# EAGLE schematic mmu6100x (EAGLE 6.6.0)

## Sheet 1 of 3
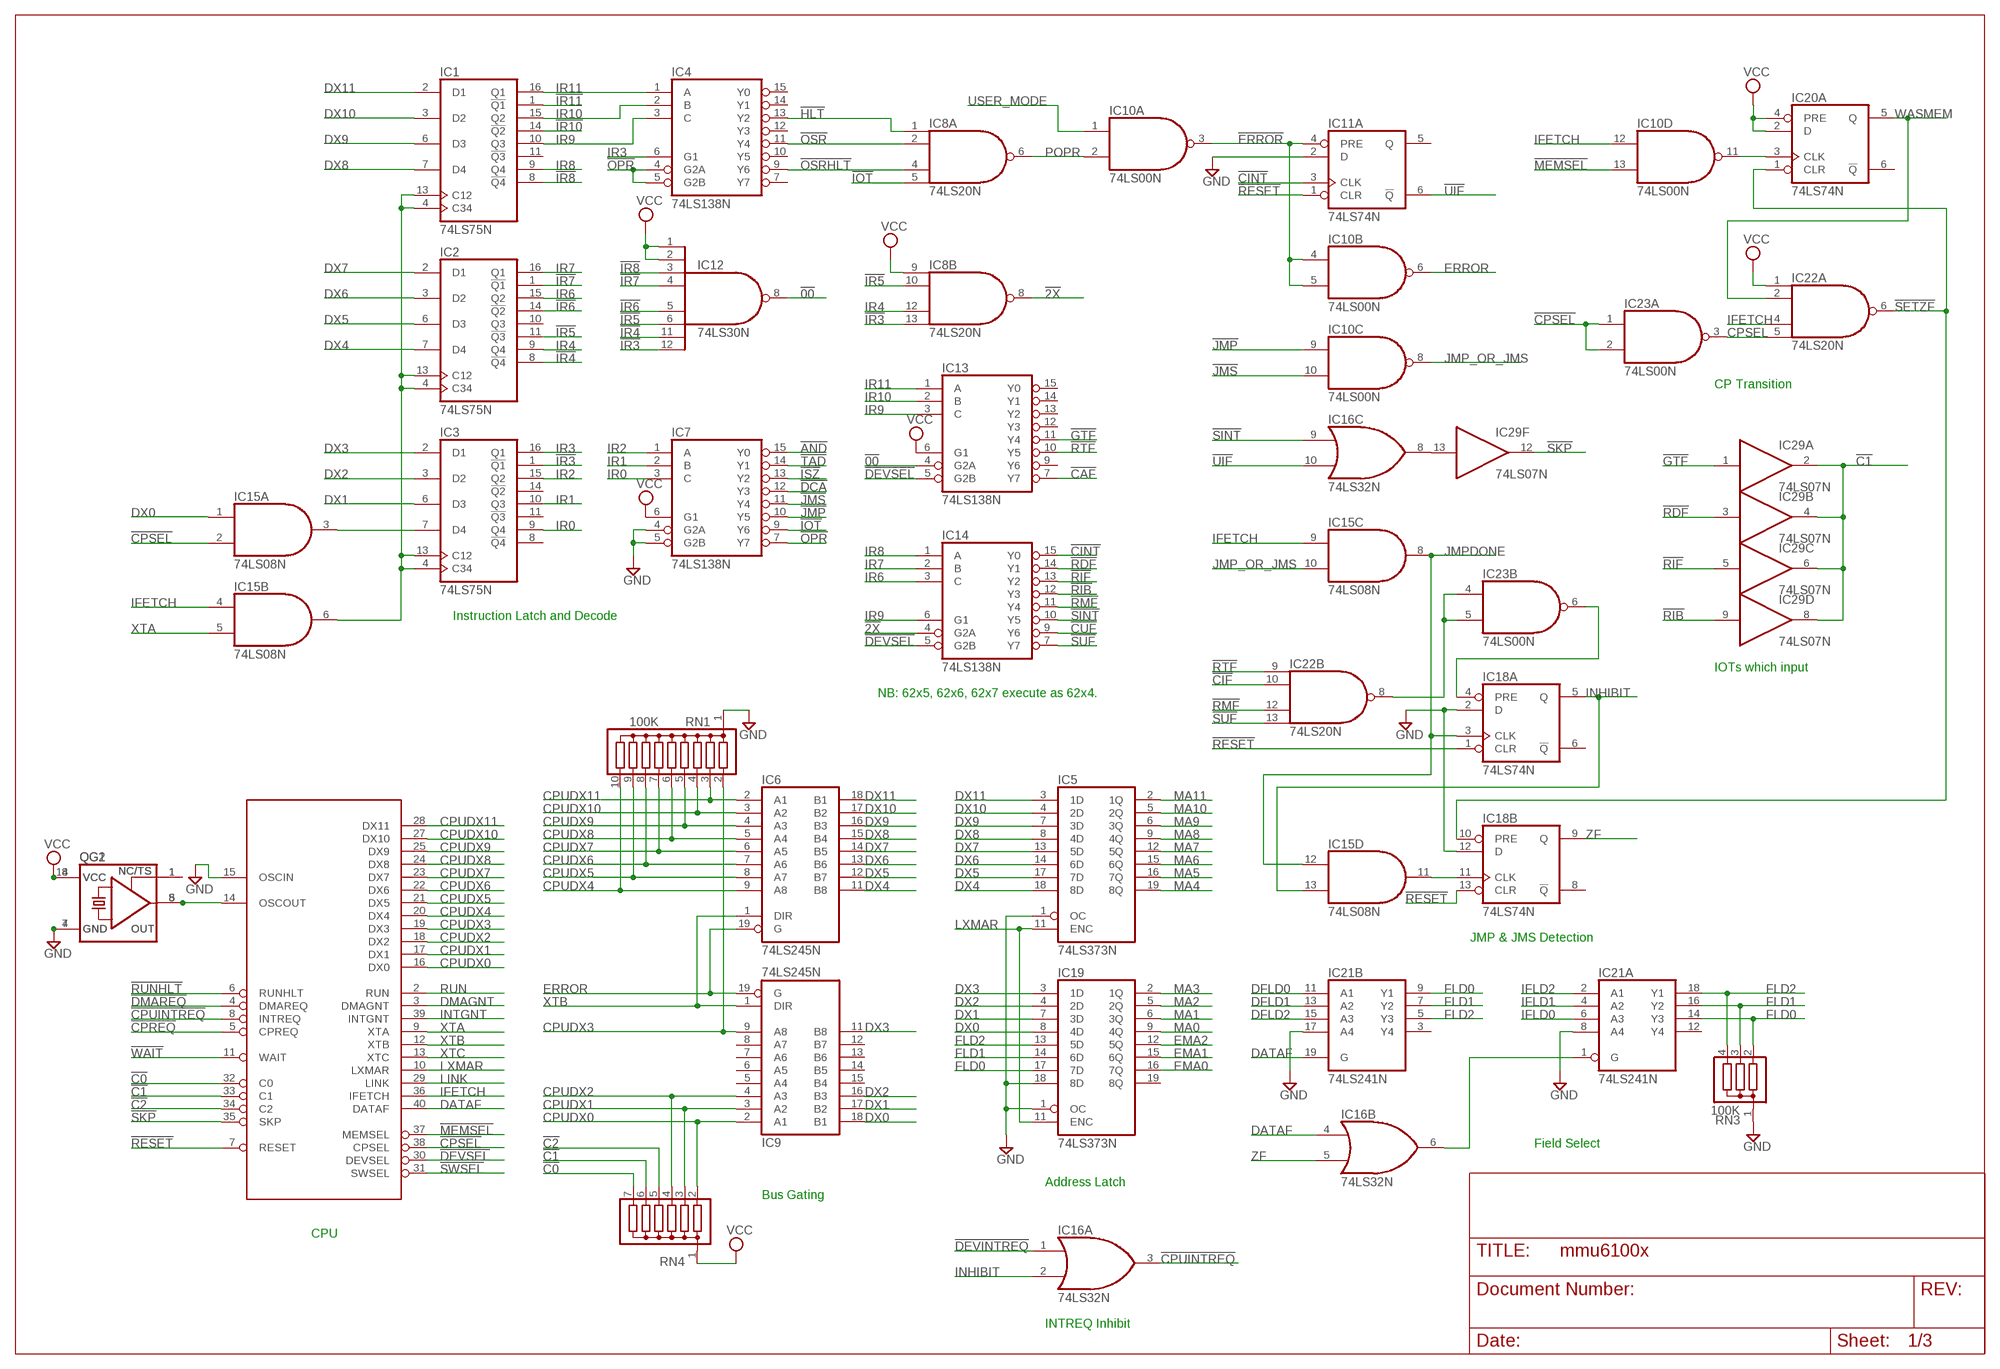
[diagram p0: schematic, sheet 1]

### Parts
CPU  IM6100  [DIL40]
IC1  74LS75N  [DIL16]
IC2  74LS75N  [DIL16]
IC3  74LS75N  [DIL16]
IC4  74LS138N  [DIL16]
IC5  74LS373N  [DIL20]
IC6  74LS245N  [DIL20]
IC7  74LS138N  [DIL16]
IC8  74LS20N  [DIL14]
IC9  74LS245N  [DIL20]
IC10  74LS00N  [DIL14]
IC11  74LS74N  [DIL14]
IC12  74LS30N  [DIL14]
IC13  74LS138N  [DIL16]
IC14  74LS138N  [DIL16]
IC15  74LS08N  [DIL14]
IC16  74LS32N  [DIL14]
IC18  74LS74N  [DIL14]
IC19  74LS373N  [DIL20]
IC20  74LS74N  [DIL14]
IC21  74LS241N  [DIL20]
IC22  74LS20N  [DIL14]
IC23  74LS00N  [DIL14]
IC29  74LS07N  [DIL14]
QG1  XO-8  [DIL08S]
QG2  XO-14  [DIL14S]
RN1  100K  G09R  [SIL10]
RN3  100K  G03R  [SIL4]
RN4  G06R  [SIL7]

### Nets
!00: IC12.8(O) IC13.4(G2A)
!2X: IC8.8(B:O) IC14.4(G2A) ; also sheet 2
!AND: IC7.15(Y0) ; also sheet 3
!C0: CPU.32(C0) RN4.7 ; also sheet 3
!C1: CPU.33(C1) IC29.2(A:O) IC29.4(B:O) IC29.6(C:O) IC29.8(D:O) RN4.6 ; also sheet 3
!C2: CPU.34(C2) RN4.5 ; also sheet 3
!CAF: IC13.7(Y7) ; also sheet 2
!CIF: IC22.10(B:I1) ; also sheet 2
!CINT: IC11.3(A:CLK) IC14.15(Y0)
!CPREQ: CPU.5(CPREQ) ; also sheet 3
!CPSEL: CPU.38(CPSEL) IC15.2(A:I1) IC23.1(A:I0) IC23.2(A:I1)
!CPUINTREQ: CPU.8(INTREQ) IC16.3(A:O)
!CUF: IC14.9(Y6) ; also sheet 2
!DCA: IC7.12(Y3) ; also sheet 3
!DEVINTREQ: IC16.1(A:I0) ; also sheet 2,3
!DEVSEL: CPU.30(DEVSEL) IC13.5(G2B) IC14.5(G2B) ; also sheet 3
!DMAREQ: CPU.4(DMAREQ) ; also sheet 3
!ERROR: IC10.3(A:O) IC10.4(B:I0) IC10.5(B:I1) IC11.4(A:PRE)
!GTF: IC13.11(Y4) IC29.1(A:I) ; also sheet 2
!HLT: IC4.13(Y2) IC8.1(A:I0)
!IOT: IC7.9(Y6) IC8.5(A:I3) ; also sheet 2
!IR3: IC3.1(!Q1) IC8.13(B:I3) IC12.12(I7)
!IR4: IC2.8(!Q4) IC12.11(I6)
!IR5: IC2.11(!Q3) IC8.10(B:I1) IC12.6(I5)
!IR6: IC2.14(!Q2) IC12.5(I4)
!IR7: IC2.1(!Q1) IC12.4(I3)
!IR8: IC1.8(!Q4) IC12.3(I2)
!IR10: IC1.14(!Q2) ; also sheet 2
!IR11: IC1.1(!Q1) ; also sheet 2
!ISZ: IC7.13(Y2) ; also sheet 3
!JMP: IC7.10(Y5) IC10.9(C:I0)
!JMS: IC7.11(Y4) IC10.10(C:I1)
!MEMSEL: CPU.37(MEMSEL) IC10.13(D:I1) ; also sheet 3
!OPR: IC4.4(G2A) IC4.5(G2B) IC7.7(Y7)
!OSR: IC4.11(Y4) IC8.2(A:I1)
!OSRHLT: IC4.9(Y6) IC8.4(A:I2)
!RDF: IC14.14(Y1) IC29.3(B:I) ; also sheet 2
!RESET: CPU.7(RESET) IC11.1(A:CLR) IC18.1(A:CLR) IC18.13(B:CLR) ; also sheet 2,3
!RIB: IC14.12(Y3) IC29.9(D:I) ; also sheet 2
!RIF: IC14.13(Y2) IC29.5(C:I) ; also sheet 2
!RMF: IC14.11(Y4) IC22.12(B:I2) ; also sheet 2
!RTF: IC13.10(Y5) IC22.9(B:I0) ; also sheet 2
!RUNHLT: CPU.6(RUNHLT) ; also sheet 3
!SETZF: IC18.10(B:PRE) IC20.1(A:CLR) IC22.6(A:O)
!SINT: IC14.10(Y5) IC16.9(C:I0)
!SKP: CPU.35(SKP) IC29.12(F:O) ; also sheet 3
!SUF: IC14.7(Y7) IC22.13(B:I3) ; also sheet 2
!SWSEL: CPU.31(SWSEL) ; also sheet 3
!TAD: IC7.14(Y1) ; also sheet 3
!UIF: IC11.6(A:!Q) IC16.10(C:I1)
!WAIT: CPU.11(WAIT) ; also sheet 3
CPSEL: IC22.5(A:I3) IC23.3(A:O)
CPUDX0: CPU.16(DX0) IC9.2(A1) RN4.2
CPUDX1: CPU.17(DX1) IC9.3(A2) RN4.3
CPUDX2: CPU.18(DX2) IC9.4(A3) RN4.4
CPUDX3: CPU.19(DX3) IC9.9(A8) RN1.2
CPUDX4: CPU.20(DX4) IC6.9(A8) RN1.10
CPUDX5: CPU.21(DX5) IC6.8(A7) RN1.9
CPUDX6: CPU.22(DX6) IC6.7(A6) RN1.8
CPUDX7: CPU.23(DX7) IC6.6(A5) RN1.7
CPUDX8: CPU.24(DX8) IC6.5(A4) RN1.6
CPUDX9: CPU.25(DX9) IC6.4(A3) RN1.5
CPUDX10: CPU.27(DX10) IC6.3(A2) RN1.4
CPUDX11: CPU.28(DX11) IC6.2(A1) RN1.3
DATAF: CPU.40(DATAF) IC16.4(B:I0) IC21.19(B:G)
DFLD0: IC21.11(B:A1) ; also sheet 2
DFLD1: IC21.13(B:A2) ; also sheet 2
DFLD2: IC21.15(B:A3) ; also sheet 2
DMAGNT: CPU.3(DMAGNT) ; also sheet 3
DX0: IC9.18(B1) IC15.1(A:I0) IC19.8(4D) ; also sheet 2,3
DX1: IC3.6(D3) IC9.17(B2) IC19.7(3D) ; also sheet 2,3
DX2: IC3.3(D2) IC9.16(B3) IC19.4(2D) ; also sheet 2,3
DX3: IC3.2(D1) IC9.11(B8) IC19.3(1D) ; also sheet 2,3
DX4: IC2.7(D4) IC5.18(8D) IC6.11(B8) ; also sheet 2,3
DX5: IC2.6(D3) IC5.17(7D) IC6.12(B7) ; also sheet 2,3
DX6: IC2.3(D2) IC5.14(6D) IC6.13(B6) ; also sheet 2,3
DX7: IC2.2(D1) IC5.13(5D) IC6.14(B5) ; also sheet 2,3
DX8: IC1.7(D4) IC5.8(4D) IC6.15(B4) ; also sheet 2,3
DX9: IC1.6(D3) IC5.7(3D) IC6.16(B3) ; also sheet 2,3
DX10: IC1.3(D2) IC5.4(2D) IC6.17(B2) ; also sheet 2,3
DX11: IC1.2(D1) IC5.3(1D) IC6.18(B1) ; also sheet 2,3
EMA0: IC19.16(7Q) ; also sheet 3
EMA1: IC19.15(6Q) ; also sheet 3
EMA2: IC19.12(5Q) ; also sheet 3
ERROR: IC6.19(G) IC9.19(G) IC10.6(B:O)
FLD0: IC19.17(7D) IC21.9(B:Y1) IC21.14(A:Y3) RN3.2
FLD1: IC19.14(6D) IC21.7(B:Y2) IC21.16(A:Y2) RN3.3
FLD2: IC19.13(5D) IC21.5(B:Y3) IC21.18(A:Y1) RN3.4
GND: CPU.15(OSCIN) IC5.1(OC) IC7.4(G2A) IC7.5(G2B) IC11.2(A:D) IC18.2(A:D) IC18.12(B:D) IC19.1(OC) IC19.18(8D) IC21.8(A:A4) IC21.17(B:A4) QG1.4(GND) QG2.7(GND) RN1.1 RN3.1 ; also sheet 2,3
IFETCH: CPU.36(IFETCH) IC10.12(D:I0) IC15.4(B:I0) IC15.9(C:I0) IC22.4(A:I2)
IFLD0: IC21.6(A:A3) ; also sheet 2
IFLD1: IC21.4(A:A2) ; also sheet 2
IFLD2: IC21.2(A:A1) ; also sheet 2
INHIBIT: IC15.13(D:I1) IC16.2(A:I1) IC18.5(A:Q) ; also sheet 2
INTGNT: CPU.39(INTGNT) ; also sheet 2,3
IR0: IC3.9(Q4) IC7.3(C)
IR1: IC3.10(Q3) IC7.2(B)
IR2: IC3.15(Q2) IC7.1(A)
IR3: IC3.16(Q1) IC4.6(G1)
IR4: IC2.9(Q4) IC8.12(B:I2)
IR6: IC2.15(Q2) IC14.3(C) ; also sheet 2
IR7: IC2.16(Q1) IC14.2(B) ; also sheet 2
IR8: IC1.9(Q4) IC14.1(A) ; also sheet 2
IR9: IC1.10(Q3) IC4.3(C) IC13.3(C) IC14.6(G1) ; also sheet 2
IR10: IC1.15(Q2) IC4.2(B) IC13.2(B)
IR11: IC1.16(Q1) IC4.1(A) IC13.1(A)
JMP_OR_JMS: IC10.8(C:O) IC15.10(C:I1)
JMPDONE: IC15.8(C:O) IC15.12(D:I0) IC18.3(A:CLK) ; also sheet 2
LINK: CPU.29(LINK) ; also sheet 3
LXMAR: CPU.10(LXMAR) IC5.11(ENC) IC19.11(ENC) ; also sheet 2,3
MA0: IC19.9(4Q) ; also sheet 3
MA1: IC19.6(3Q) ; also sheet 3
MA2: IC19.5(2Q) ; also sheet 3
MA3: IC19.2(1Q) ; also sheet 3
MA4: IC5.19(8Q) ; also sheet 3
MA5: IC5.16(7Q) ; also sheet 3
MA6: IC5.15(6Q) ; also sheet 3
MA7: IC5.12(5Q) ; also sheet 3
MA8: IC5.9(4Q) ; also sheet 3
MA9: IC5.6(3Q) ; also sheet 3
MA10: IC5.5(2Q) ; also sheet 3
MA11: IC5.2(1Q) ; also sheet 3
N$2: QG1.1(TS) QG2.1(TS)
N$3: IC1.4(C34) IC1.13(C12) IC2.4(C34) IC2.13(C12) IC3.4(C34) IC3.13(C12) IC15.6(B:O)
N$5: IC15.11(D:O) IC18.11(B:CLK)
N$6: IC10.11(D:O) IC20.3(A:CLK)
N$8: IC16.6(B:O) IC21.1(A:G)
N$15: IC3.7(D4) IC15.3(A:O)
N$23: IC16.8(C:O) IC29.13(F:I)
N$29: IC22.8(B:O) IC23.4(B:I0) IC23.5(B:I1)
N$30: IC18.4(A:PRE) IC23.6(B:O)
OSCOUT: CPU.14(OSCOUT) QG1.5(OUT) QG2.8(OUT)
POPR: IC8.6(A:O) IC10.2(A:I1)
RUN: CPU.2(RUN) ; also sheet 3
USER_MODE: IC10.1(A:I0) ; also sheet 2
VCC: IC7.6(G1) IC8.9(B:I0) IC12.1(I0) IC12.2(I1) IC13.6(G1) IC20.2(A:D) IC20.4(A:PRE) IC22.1(A:I0) QG1.8(VCC) QG2.14(VCC) RN4.1 ; also sheet 2,3
WASMEM: IC20.5(A:Q) IC22.2(A:I1)
XTA: CPU.9(XTA) IC15.5(B:I1) ; also sheet 2,3
XTB: CPU.12(XTB) IC6.1(DIR) IC9.1(DIR) ; also sheet 2,3
XTC: CPU.13(XTC) ; also sheet 3
ZF: IC16.5(B:I1) IC18.9(B:Q)
Unconnected: IC1.11(!Q3) IC2.10(Q3) IC3.8(!Q4) IC3.11(!Q3) IC3.14(!Q2) IC4.7(Y7) IC4.10(Y5) IC4.12(Y3) IC4.14(Y1) IC4.15(Y0) IC9.5(A4) IC9.6(A5) IC9.7(A6) IC9.8(A7) IC9.12(B7) IC9.13(B6) IC9.14(B5) IC9.15(B4) IC11.5(A:Q) IC13.9(Y6) IC13.12(Y3) IC13.13(Y2) IC13.14(Y1) IC13.15(Y0) IC18.6(A:!Q) IC18.8(B:!Q) IC19.19(8Q) IC20.6(A:!Q) IC21.3(B:Y4) IC21.12(A:Y4)

### Notes on the sheet
- CP Transition
- Instruction Latch and Decode
- IOTs which input
- NB: 62x5, 62x6, 62x7 execute as 62x4.
- JMP & JMS Detection
- Field Select
- Address Latch
- Bus Gating
- CPU
- INTREQ Inhibit

## Sheet 2 of 3
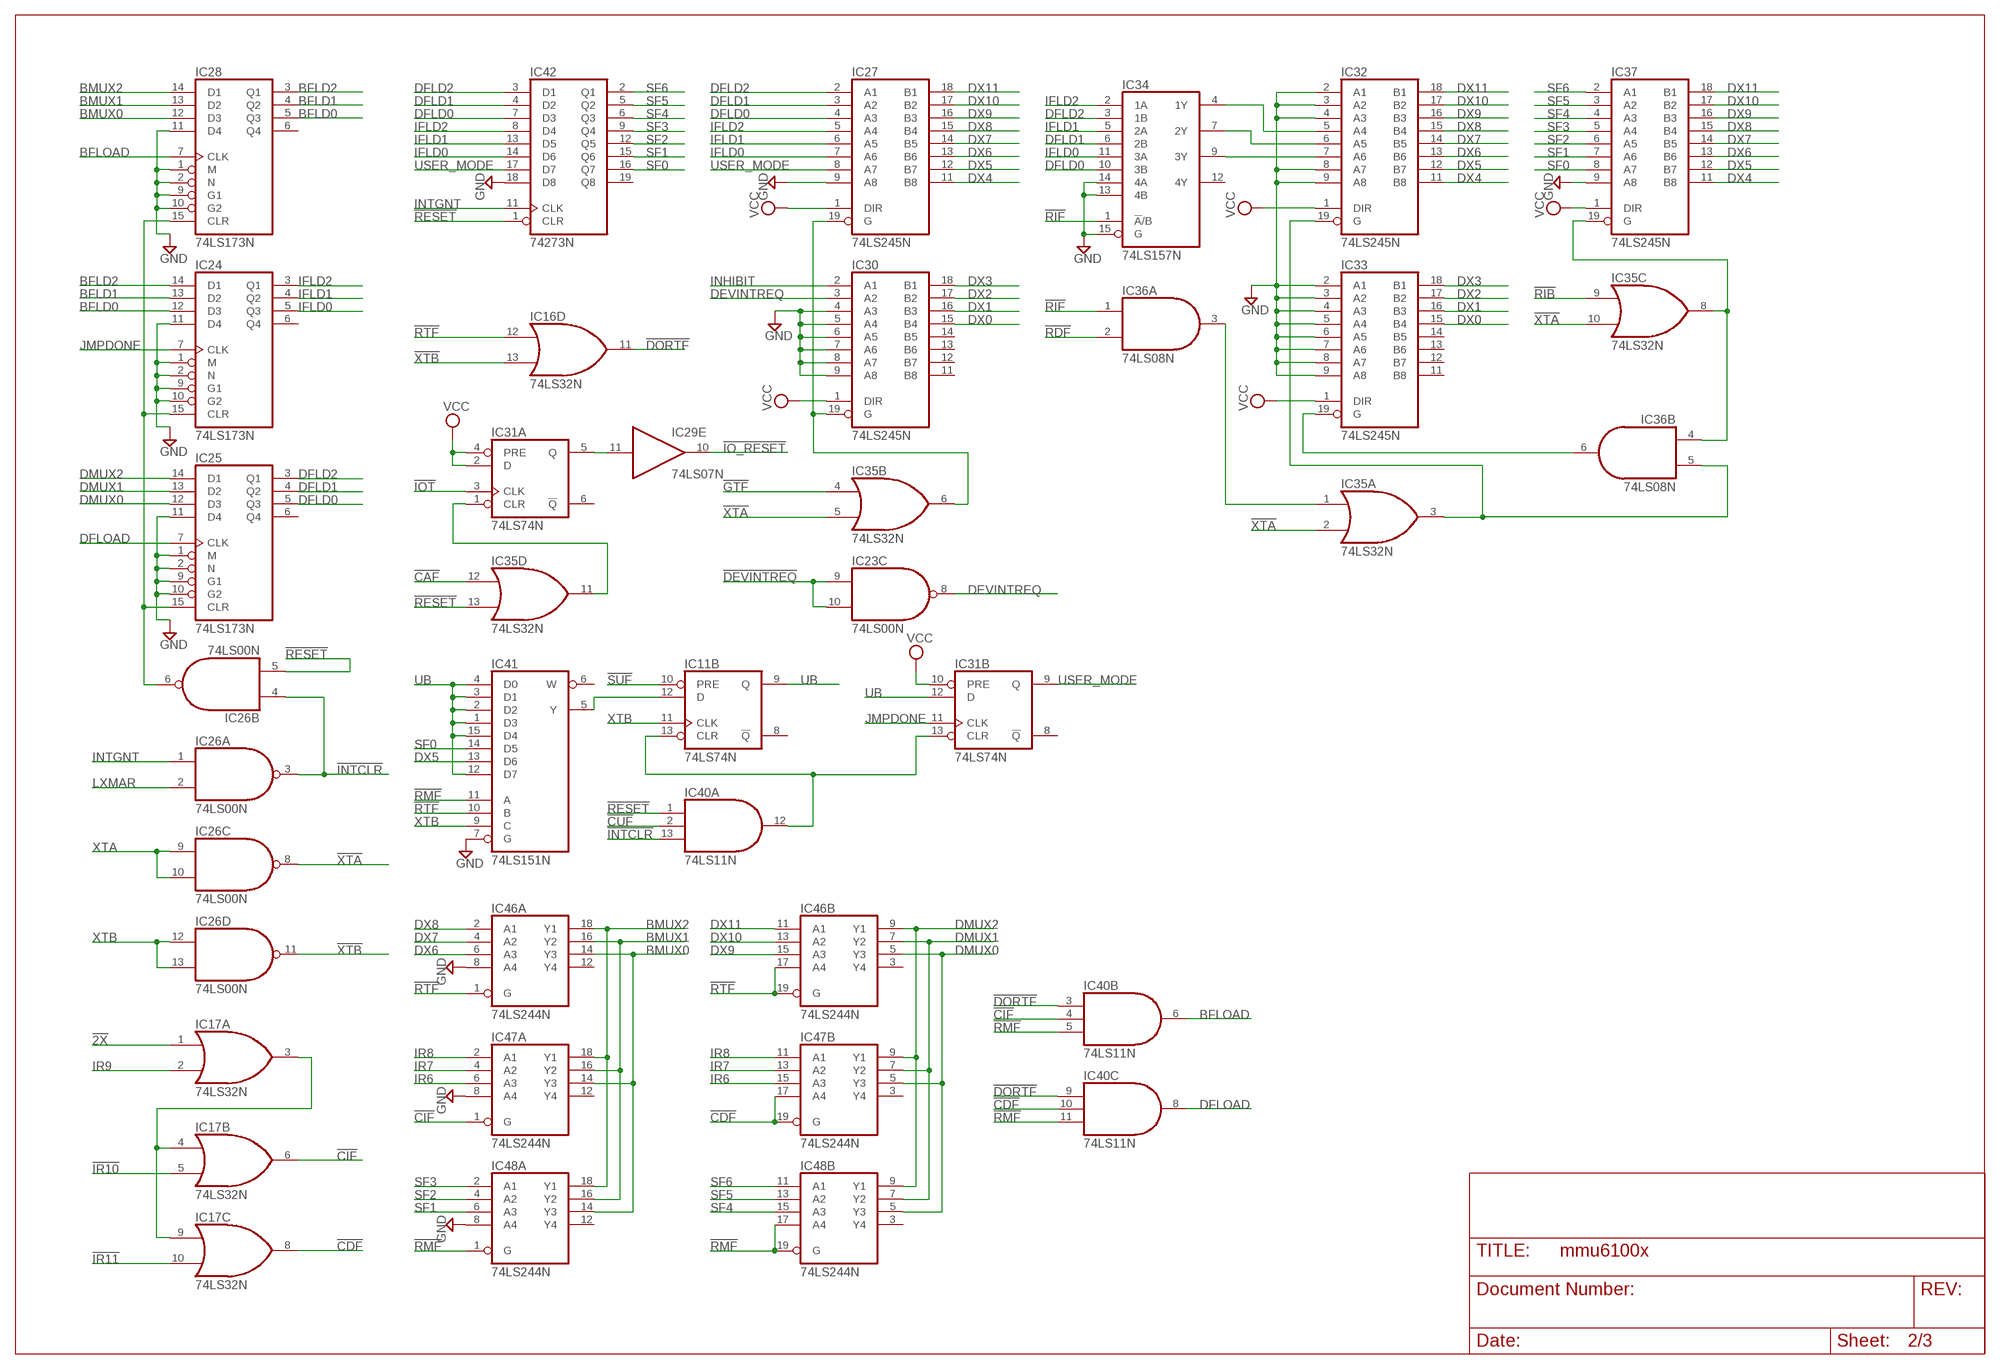
[diagram p1: schematic, sheet 2]

### Parts
IC17  74LS32N  [DIL14]
IC24  74LS173N  [DIL16]
IC25  74LS173N  [DIL16]
IC26  74LS00N  [DIL14]
IC27  74LS245N  [DIL20]
IC28  74LS173N  [DIL16]
IC30  74LS245N  [DIL20]
IC31  74LS74N  [DIL14]
IC32  74LS245N  [DIL20]
IC33  74LS245N  [DIL20]
IC34  74LS157N  [DIL16]
IC35  74LS32N  [DIL14]
IC36  74LS08N  [DIL14]
IC37  74LS245N  [DIL20]
IC40  74LS11N  [DIL14]
IC41  74LS151N  [DIL16]
IC42  74273N  [DIL20]
IC46  74LS244N  [DIL20]
IC47  74LS244N  [DIL20]
IC48  74LS244N  [DIL20]

### Nets
!2X: IC17.1(A:I0) ; also sheet 1
!CAF: IC35.12(D:I0) ; also sheet 1
!CDF: IC17.8(C:O) IC40.10(C:I1) IC47.17(B:A4) IC47.19(B:G)
!CIF: IC17.6(B:O) IC40.4(B:I1) IC47.1(A:G) ; also sheet 1
!CUF: IC40.2(A:I1) ; also sheet 1
!DEVINTREQ: IC23.9(C:I0) IC23.10(C:I1) ; also sheet 1,3
!DORTF: IC16.11(D:O) IC40.3(B:I0) IC40.9(C:I0)
!GTF: IC35.4(B:I0) ; also sheet 1
!INTCLR: IC26.3(A:O) IC26.4(B:I0) IC40.13(A:I2)
!IO_RESET: IC29.10(E:O) ; also sheet 3
!IOT: IC31.3(A:CLK) ; also sheet 1
!IR10: IC17.5(B:I1) ; also sheet 1
!IR11: IC17.10(C:I1) ; also sheet 1
!RDF: IC36.2(A:I1) ; also sheet 1
!RESET: IC26.5(B:I1) IC35.13(D:I1) IC40.1(A:I0) IC42.1(CLR) ; also sheet 1,3
!RIB: IC35.9(C:I0) ; also sheet 1
!RIF: IC34.1(!A!/B) IC36.1(A:I0) ; also sheet 1
!RMF: IC40.5(B:I2) IC40.11(C:I2) IC41.11(A) IC48.1(A:G) IC48.17(B:A4) IC48.19(B:G) ; also sheet 1
!RTF: IC16.12(D:I0) IC41.10(B) IC46.1(A:G) IC46.17(B:A4) IC46.19(B:G) ; also sheet 1
!SUF: IC11.10(B:PRE) ; also sheet 1
!XTA: IC26.8(C:O) IC35.2(A:I1) IC35.5(B:I1) IC35.10(C:I1) ; also sheet 3
!XTB: IC16.13(D:I1) IC26.11(D:O) ; also sheet 3
BFLD0: IC24.12(D3) IC28.5(Q3)
BFLD1: IC24.13(D2) IC28.4(Q2)
BFLD2: IC24.14(D1) IC28.3(Q1)
BFLOAD: IC28.7(CLK) IC40.6(B:O)
BMUX0: IC28.12(D3) IC46.14(A:Y3) IC47.14(A:Y3) IC48.14(A:Y3)
BMUX1: IC28.13(D2) IC46.16(A:Y2) IC47.16(A:Y2) IC48.16(A:Y2)
BMUX2: IC28.14(D1) IC46.18(A:Y1) IC47.18(A:Y1) IC48.18(A:Y1)
DEVINTREQ: IC23.8(C:O) IC30.3(A2)
DFLD0: IC25.5(Q3) IC27.4(A3) IC34.10(3B) IC42.7(D3) ; also sheet 1
DFLD1: IC25.4(Q2) IC27.3(A2) IC34.6(2B) IC42.4(D2) ; also sheet 1
DFLD2: IC25.3(Q1) IC27.2(A1) IC34.3(1B) IC42.3(D1) ; also sheet 1
DFLOAD: IC25.7(CLK) IC40.8(C:O)
DMUX0: IC25.12(D3) IC46.5(B:Y3) IC47.5(B:Y3) IC48.5(B:Y3)
DMUX1: IC25.13(D2) IC46.7(B:Y2) IC47.7(B:Y2) IC48.7(B:Y2)
DMUX2: IC25.14(D1) IC46.9(B:Y1) IC47.9(B:Y1) IC48.9(B:Y1)
DX0: IC30.15(B4) IC33.15(B4) ; also sheet 1,3
DX1: IC30.16(B3) IC33.16(B3) ; also sheet 1,3
DX2: IC30.17(B2) IC33.17(B2) ; also sheet 1,3
DX3: IC30.18(B1) IC33.18(B1) ; also sheet 1,3
DX4: IC27.11(B8) IC32.11(B8) IC37.11(B8) ; also sheet 1,3
DX5: IC27.12(B7) IC32.12(B7) IC37.12(B7) IC41.13(D6) ; also sheet 1,3
DX6: IC27.13(B6) IC32.13(B6) IC37.13(B6) IC46.6(A:A3) ; also sheet 1,3
DX7: IC27.14(B5) IC32.14(B5) IC37.14(B5) IC46.4(A:A2) ; also sheet 1,3
DX8: IC27.15(B4) IC32.15(B4) IC37.15(B4) IC46.2(A:A1) ; also sheet 1,3
DX9: IC27.16(B3) IC32.16(B3) IC37.16(B3) IC46.15(B:A3) ; also sheet 1,3
DX10: IC27.17(B2) IC32.17(B2) IC37.17(B2) IC46.13(B:A2) ; also sheet 1,3
DX11: IC27.18(B1) IC32.18(B1) IC37.18(B1) IC46.11(B:A1) ; also sheet 1,3
GND: IC24.1(M) IC24.2(N) IC24.9(G1) IC24.10(G2) IC24.11(D4) IC25.1(M) IC25.2(N) IC25.9(G1) IC25.10(G2) IC25.11(D4) IC27.9(A8) IC28.1(M) IC28.2(N) IC28.9(G1) IC28.10(G2) IC28.11(D4) IC30.4(A3) IC30.5(A4) IC30.6(A5) IC30.7(A6) IC30.8(A7) IC30.9(A8) IC32.2(A1) IC32.3(A2) IC32.4(A3) IC32.8(A7) IC32.9(A8) IC33.2(A1) IC33.3(A2) IC33.4(A3) IC33.5(A4) IC33.6(A5) IC33.7(A6) IC33.8(A7) IC33.9(A8) IC34.13(4B) IC34.14(4A) IC34.15(G) IC37.9(A8) IC41.7(G) IC42.18(D8) IC46.8(A:A4) IC47.8(A:A4) IC48.8(A:A4) ; also sheet 1,3
IFLD0: IC24.5(Q3) IC27.7(A6) IC34.11(3A) IC42.14(D6) ; also sheet 1
IFLD1: IC24.4(Q2) IC27.6(A5) IC34.5(2A) IC42.13(D5) ; also sheet 1
IFLD2: IC24.3(Q1) IC27.5(A4) IC34.2(1A) IC42.8(D4) ; also sheet 1
INHIBIT: IC30.2(A1) ; also sheet 1
INTCLR: IC24.15(CLR) IC25.15(CLR) IC26.6(B:O) IC28.15(CLR)
INTGNT: IC26.1(A:I0) IC42.11(CLK) ; also sheet 1,3
IR6: IC47.6(A:A3) IC47.15(B:A3) ; also sheet 1
IR7: IC47.4(A:A2) IC47.13(B:A2) ; also sheet 1
IR8: IC47.2(A:A1) IC47.11(B:A1) ; also sheet 1
IR9: IC17.2(A:I1) ; also sheet 1
JMPDONE: IC24.7(CLK) IC31.11(B:CLK) ; also sheet 1
LXMAR: IC26.2(A:I1) ; also sheet 1,3
N$4: IC27.19(G) IC30.19(G) IC35.6(B:O)
N$7: IC29.11(E:I) IC31.5(A:Q)
N$9: IC32.19(G) IC35.3(A:O) IC36.5(B:I1)
N$12: IC35.8(C:O) IC36.4(B:I0) IC37.19(G)
N$14: IC32.5(A4) IC34.4(1Y)
N$19: IC32.6(A5) IC34.7(2Y)
N$22: IC32.7(A6) IC34.9(3Y)
N$24: IC35.1(A:I0) IC36.3(A:O)
N$25: IC33.19(G) IC36.6(B:O)
N$26: IC11.13(B:CLR) IC31.13(B:CLR) IC40.12(A:O)
N$27: IC11.12(B:D) IC41.5(Y)
N$28: IC31.1(A:CLR) IC35.11(D:O)
N$33: IC17.3(A:O) IC17.4(B:I0) IC17.9(C:I0)
SF0: IC37.8(A7) IC41.14(D5) IC42.16(Q7)
SF1: IC37.7(A6) IC42.15(Q6) IC48.6(A:A3)
SF2: IC37.6(A5) IC42.12(Q5) IC48.4(A:A2)
SF3: IC37.5(A4) IC42.9(Q4) IC48.2(A:A1)
SF4: IC37.4(A3) IC42.6(Q3) IC48.15(B:A3)
SF5: IC37.3(A2) IC42.5(Q2) IC48.13(B:A2)
SF6: IC37.2(A1) IC42.2(Q1) IC48.11(B:A1)
UB: IC11.9(B:Q) IC31.12(B:D) IC41.1(D3) IC41.2(D2) IC41.3(D1) IC41.4(D0) IC41.12(D7) IC41.15(D4)
USER_MODE: IC27.8(A7) IC31.9(B:Q) IC42.17(D7) ; also sheet 1
VCC: IC27.1(DIR) IC30.1(DIR) IC31.2(A:D) IC31.4(A:PRE) IC31.10(B:PRE) IC32.1(DIR) IC33.1(DIR) IC37.1(DIR) ; also sheet 1,3
XTA: IC26.9(C:I0) IC26.10(C:I1) ; also sheet 1,3
XTB: IC11.11(B:CLK) IC26.12(D:I0) IC26.13(D:I1) IC41.9(C) ; also sheet 1,3
Unconnected: IC11.8(B:!Q) IC24.6(Q4) IC25.6(Q4) IC28.6(Q4) IC30.11(B8) IC30.12(B7) IC30.13(B6) IC30.14(B5) IC31.6(A:!Q) IC31.8(B:!Q) IC33.11(B8) IC33.12(B7) IC33.13(B6) IC33.14(B5) IC34.12(4Y) IC41.6(W) IC42.19(Q8) IC46.3(B:Y4) IC46.12(A:Y4) IC47.3(B:Y4) IC47.12(A:Y4) IC48.3(B:Y4) IC48.12(A:Y4)

## Sheet 3 of 3
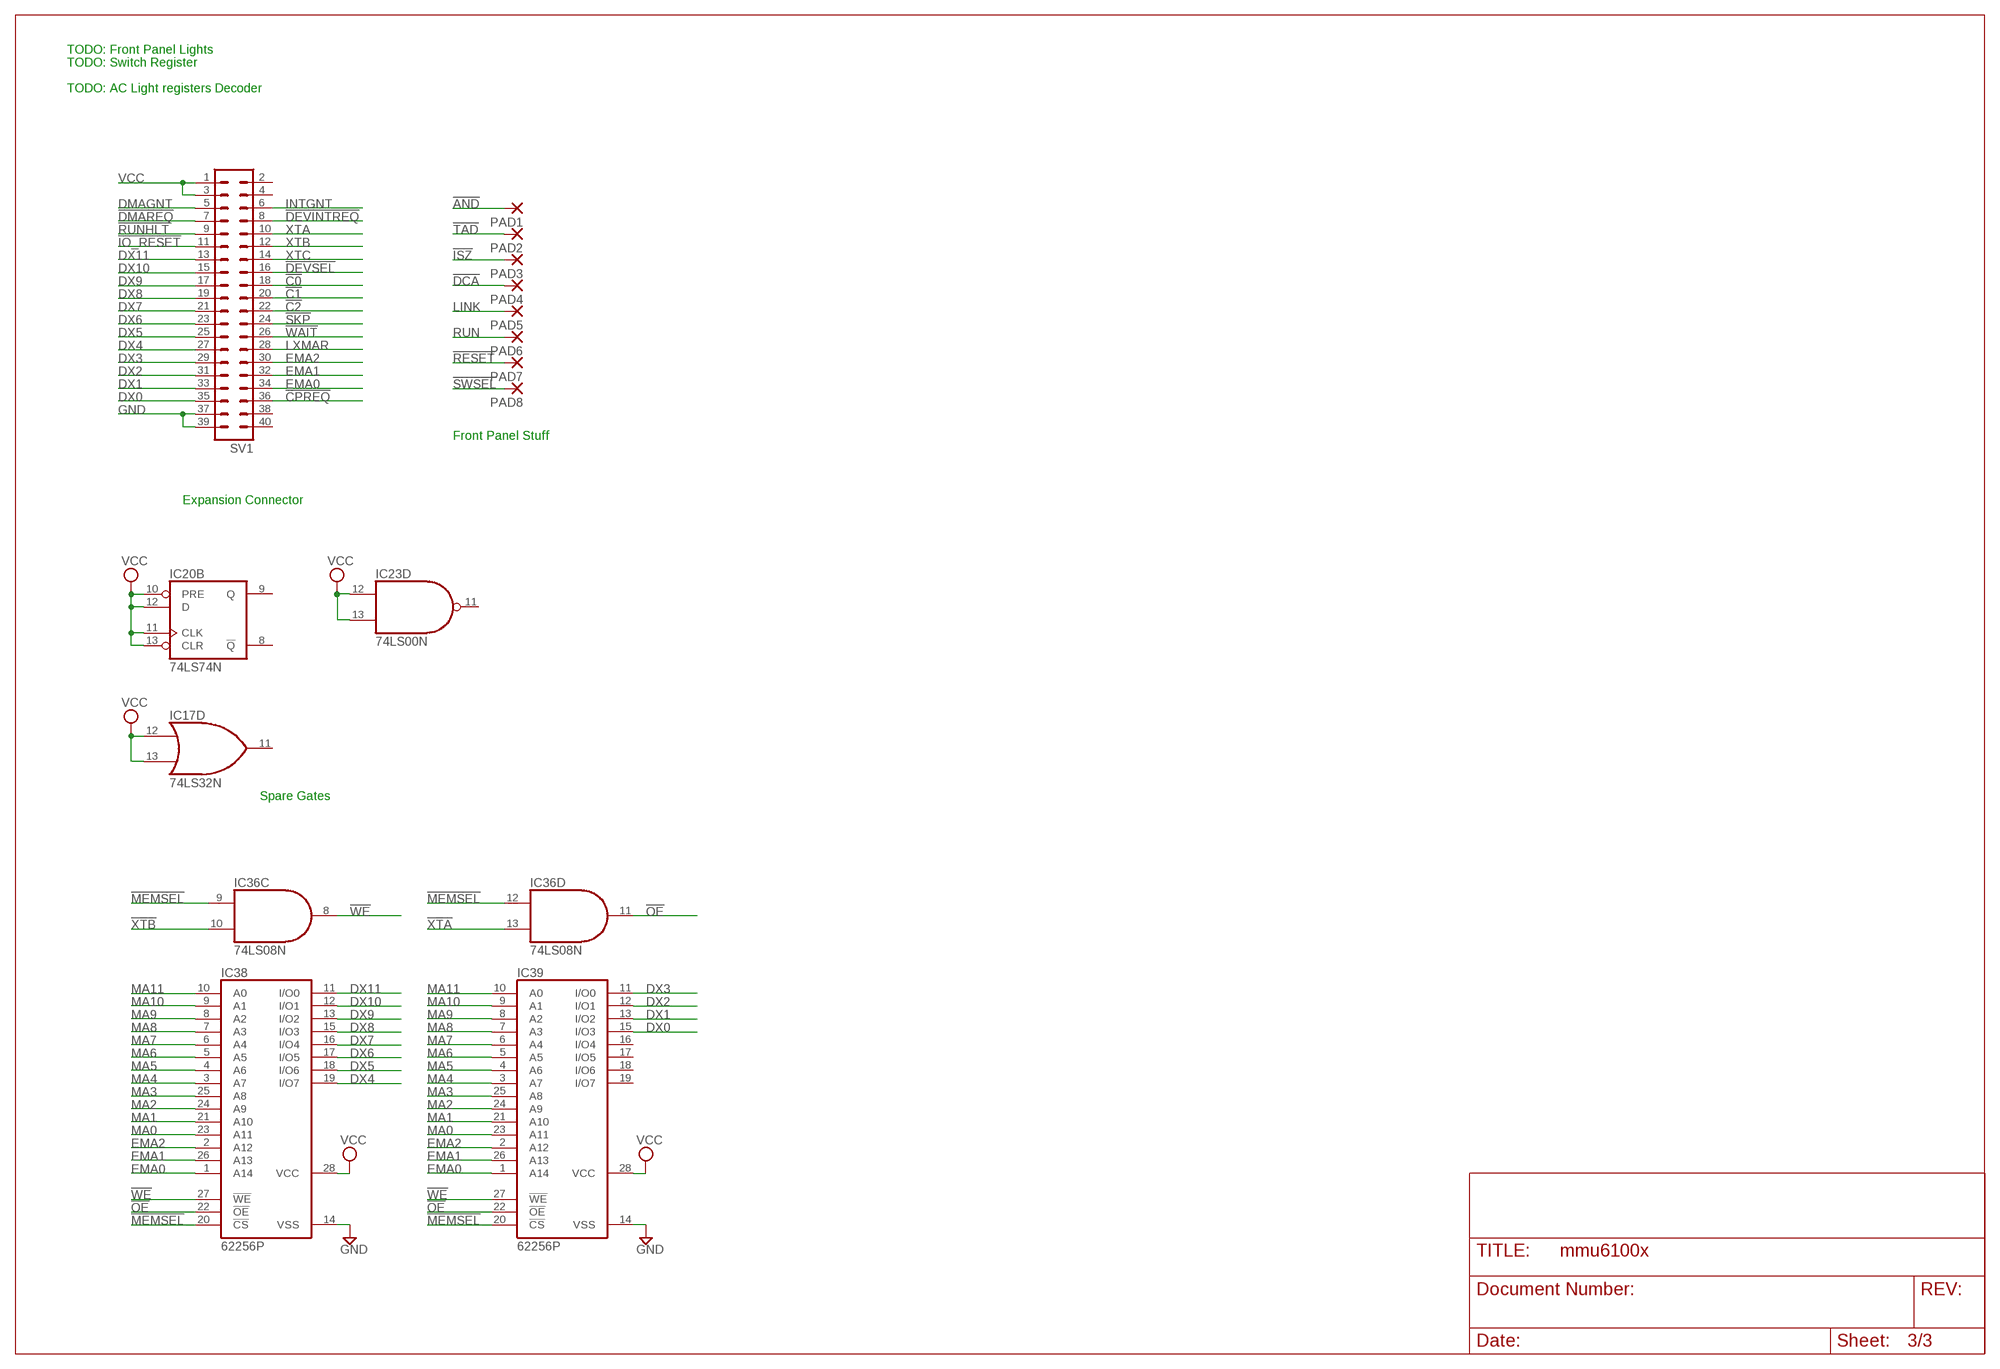
[diagram p2: schematic, sheet 3]

### Parts
IC38  62256P  [DIL28-6]
IC39  62256P  [DIL28-6]
PAD1  2,15/1,0  [2,15/1,0]
PAD2  2,15/1,0  [2,15/1,0]
PAD3  2,15/1,0  [2,15/1,0]
PAD4  2,15/1,0  [2,15/1,0]
PAD5  2,15/1,0  [2,15/1,0]
PAD6  2,15/1,0  [2,15/1,0]
PAD7  2,15/1,0  [2,15/1,0]
PAD8  2,15/1,0  [2,15/1,0]
SV1  MA20-2  [MA20-2]

### Nets
!AND: PAD1.1(P) ; also sheet 1
!C0: SV1.18 ; also sheet 1
!C1: SV1.20 ; also sheet 1
!C2: SV1.22 ; also sheet 1
!CPREQ: SV1.36 ; also sheet 1
!DCA: PAD4.1(P) ; also sheet 1
!DEVINTREQ: SV1.8 ; also sheet 1,2
!DEVSEL: SV1.16 ; also sheet 1
!DMAREQ: SV1.7 ; also sheet 1
!IO_RESET: SV1.11 ; also sheet 2
!ISZ: PAD3.1(P) ; also sheet 1
!MEMSEL: IC36.9(C:I0) IC36.12(D:I0) IC38.20(!CS) IC39.20(!CS) ; also sheet 1
!OE: IC36.11(D:O) IC38.22(!OE) IC39.22(!OE)
!RESET: PAD7.1(P) ; also sheet 1,2
!RUNHLT: SV1.9 ; also sheet 1
!SKP: SV1.24 ; also sheet 1
!SWSEL: PAD8.1(P) ; also sheet 1
!TAD: PAD2.1(P) ; also sheet 1
!WAIT: SV1.26 ; also sheet 1
!WE: IC36.8(C:O) IC38.27(!WE) IC39.27(!WE)
!XTA: IC36.13(D:I1) ; also sheet 2
!XTB: IC36.10(C:I1) ; also sheet 2
DMAGNT: SV1.5 ; also sheet 1
DX0: IC39.15(I/O3) SV1.35 ; also sheet 1,2
DX1: IC39.13(I/O2) SV1.33 ; also sheet 1,2
DX2: IC39.12(I/O1) SV1.31 ; also sheet 1,2
DX3: IC39.11(I/O0) SV1.29 ; also sheet 1,2
DX4: IC38.19(I/O7) SV1.27 ; also sheet 1,2
DX5: IC38.18(I/O6) SV1.25 ; also sheet 1,2
DX6: IC38.17(I/O5) SV1.23 ; also sheet 1,2
DX7: IC38.16(I/O4) SV1.21 ; also sheet 1,2
DX8: IC38.15(I/O3) SV1.19 ; also sheet 1,2
DX9: IC38.13(I/O2) SV1.17 ; also sheet 1,2
DX10: IC38.12(I/O1) SV1.15 ; also sheet 1,2
DX11: IC38.11(I/O0) SV1.13 ; also sheet 1,2
EMA0: IC38.1(A14) IC39.1(A14) SV1.34 ; also sheet 1
EMA1: IC38.26(A13) IC39.26(A13) SV1.32 ; also sheet 1
EMA2: IC38.2(A12) IC39.2(A12) SV1.30 ; also sheet 1
GND: IC38.14(VSS) IC39.14(VSS) SV1.37 SV1.39 ; also sheet 1,2
INTGNT: SV1.6 ; also sheet 1,2
LINK: PAD5.1(P) ; also sheet 1
LXMAR: SV1.28 ; also sheet 1,2
MA0: IC38.23(A11) IC39.23(A11) ; also sheet 1
MA1: IC38.21(A10) IC39.21(A10) ; also sheet 1
MA2: IC38.24(A9) IC39.24(A9) ; also sheet 1
MA3: IC38.25(A8) IC39.25(A8) ; also sheet 1
MA4: IC38.3(A7) IC39.3(A7) ; also sheet 1
MA5: IC38.4(A6) IC39.4(A6) ; also sheet 1
MA6: IC38.5(A5) IC39.5(A5) ; also sheet 1
MA7: IC38.6(A4) IC39.6(A4) ; also sheet 1
MA8: IC38.7(A3) IC39.7(A3) ; also sheet 1
MA9: IC38.8(A2) IC39.8(A2) ; also sheet 1
MA10: IC38.9(A1) IC39.9(A1) ; also sheet 1
MA11: IC38.10(A0) IC39.10(A0) ; also sheet 1
RUN: PAD6.1(P) ; also sheet 1
VCC: IC17.12(D:I0) IC17.13(D:I1) IC20.10(B:PRE) IC20.11(B:CLK) IC20.12(B:D) IC20.13(B:CLR) IC23.12(D:I0) IC23.13(D:I1) IC38.28(VCC) IC39.28(VCC) SV1.1 SV1.3 ; also sheet 1,2
XTA: SV1.10 ; also sheet 1,2
XTB: SV1.12 ; also sheet 1,2
XTC: SV1.14 ; also sheet 1
Unconnected: IC17.11(D:O) IC20.8(B:!Q) IC20.9(B:Q) IC23.11(D:O) IC39.16(I/O4) IC39.17(I/O5) IC39.18(I/O6) IC39.19(I/O7) SV1.2 SV1.4 SV1.38 SV1.40

### Notes on the sheet
- TODO: Front Panel Lights
- TODO: Switch Register
- TODO: AC Light registers Decoder
- Front Panel Stuff
- Expansion Connector
- Spare Gates

## Power pins joined to a net without a drawn wire
GND: CPU.26(GND) IC1.12(GND) IC2.12(GND) IC3.12(GND) IC4.8(GND) IC5.10(GND) IC6.10(GND) IC7.8(GND) IC8.7(P:GND) IC9.10(GND) IC10.7(P:GND) IC11.7(P:GND) IC12.7(GND) IC13.8(GND) IC14.8(GND) IC15.7(P:GND) IC16.7(P:GND) IC17.7(P:GND) IC18.7(P:GND) IC19.10(GND) IC20.7(P:GND) IC21.10(P:GND) IC22.7(P:GND) IC23.7(P:GND) IC24.8(GND) IC25.8(GND) IC26.7(P:GND) IC27.10(GND) IC28.8(GND) IC29.7(P:GND) IC30.10(GND) IC31.7(P:GND) IC32.10(GND) IC33.10(GND) IC34.8(GND) IC35.7(P:GND) IC36.7(P:GND) IC37.10(GND) IC40.7(P:GND) IC41.8(GND) IC42.10(GND) IC46.10(P:GND) IC47.10(P:GND) IC48.10(P:GND)
VCC: CPU.1(VCC) IC1.5(VCC) IC2.5(VCC) IC3.5(VCC) IC4.16(VCC) IC5.20(VCC) IC6.20(VCC) IC7.16(VCC) IC8.14(P:VCC) IC9.20(VCC) IC10.14(P:VCC) IC11.14(P:VCC) IC12.14(VCC) IC13.16(VCC) IC14.16(VCC) IC15.14(P:VCC) IC16.14(P:VCC) IC17.14(P:VCC) IC18.14(P:VCC) IC19.20(VCC) IC20.14(P:VCC) IC21.20(P:VCC) IC22.14(P:VCC) IC23.14(P:VCC) IC24.16(VCC) IC25.16(VCC) IC26.14(P:VCC) IC27.20(VCC) IC28.16(VCC) IC29.14(P:VCC) IC30.20(VCC) IC31.14(P:VCC) IC32.20(VCC) IC33.20(VCC) IC34.16(VCC) IC35.14(P:VCC) IC36.14(P:VCC) IC37.20(VCC) IC40.14(P:VCC) IC41.16(VCC) IC42.20(VCC) IC46.20(P:VCC) IC47.20(P:VCC) IC48.20(P:VCC)

## Library data of the parts
CPU = dec-con:IM6100: IM6100 PDP-8 on a chip.
IC1-IC3 = 74xx-us:74*75: 4-bit bistable LATCH
IC4 IC7 IC13 IC14 = 74xx-us:74*138: 3-line to 8-line DECODER/DEMULTIPLEXER
IC5 IC19 = 74xx-us:74*373: Octal D type transparent LATCH, edge triggered
IC6 IC9 IC27 IC30 IC32 IC33 IC37 = 74xx-us:74*245: Octal BUS TRANSCEIVER, 3-state
IC8 IC22 = 74xx-us:74*20: Dual 4-input NAND gate
IC10 IC23 IC26 = 74xx-us:74*00: Quad 2-input NAND gate
IC11 IC18 IC20 IC31 = 74xx-us:74*74: Dual D type positive edge triggered FLIP FLOP, preset and clear
IC12 = 74xx-us:74*30: 8-input NAND gate
IC15 IC36 = 74xx-us:74*08: Quad 2-input AND gate
IC16 IC17 IC35 = 74xx-us:74*32: Quad 2-input OR gate
IC21 = 74xx-us:74*241: Octal BUFFER and LINE DRIVER, 3-state
IC24 IC25 IC28 = 74xx-us:74*173: 4-bit D type REGISTER, 3-state
IC29 = 74xx-us:74*07: Hex BUFFER, open collector high-voltage output
IC34 = 74xx-us:74*157: Quadruple 2-line to 1-line data SELECTOR/MULTIPLEXER
IC38 IC39 = memory-hitachi:62256P: MEMORY; OC_FARNELL: unknown; OC_NEWARK: unknown
IC40 = 74xx-us:74*11: Triple 3-input AND gate
IC41 = 74xx-us:74*151: Data SELECTOR/MULTIPLEXER
IC42 = 74xx-us:74*273: Octal D type FLIP FLOP, clear
IC46-IC48 = 74xx-us:74*244: Octal BUFFER and LINE DRIVER, 3-state
PAD1-PAD8 = wirepad:2,15/1,0: THROUGH-HOLE PAD
QG1 QG2 = crystal:XO-: CRYSTAL; OC_FARNELL: unknown; OC_NEWARK: unknown
RN1 = resistor-sil:G09R: SIL RESISTOR; OC_FARNELL: unknown; OC_NEWARK: unknown
RN3 = resistor-sil:G03R: SIL RESISTOR; OC_FARNELL: unknown; OC_NEWARK: unknown
RN4 = resistor-sil:G06R: SIL RESISTOR; OC_FARNELL: unknown; OC_NEWARK: unknown
SV1 = con-lstb:MA20-2: PIN HEADER; OC_FARNELL: unknown; OC_NEWARK: unknown